# EAGLE design colourBit (EAGLE 9.5.2)
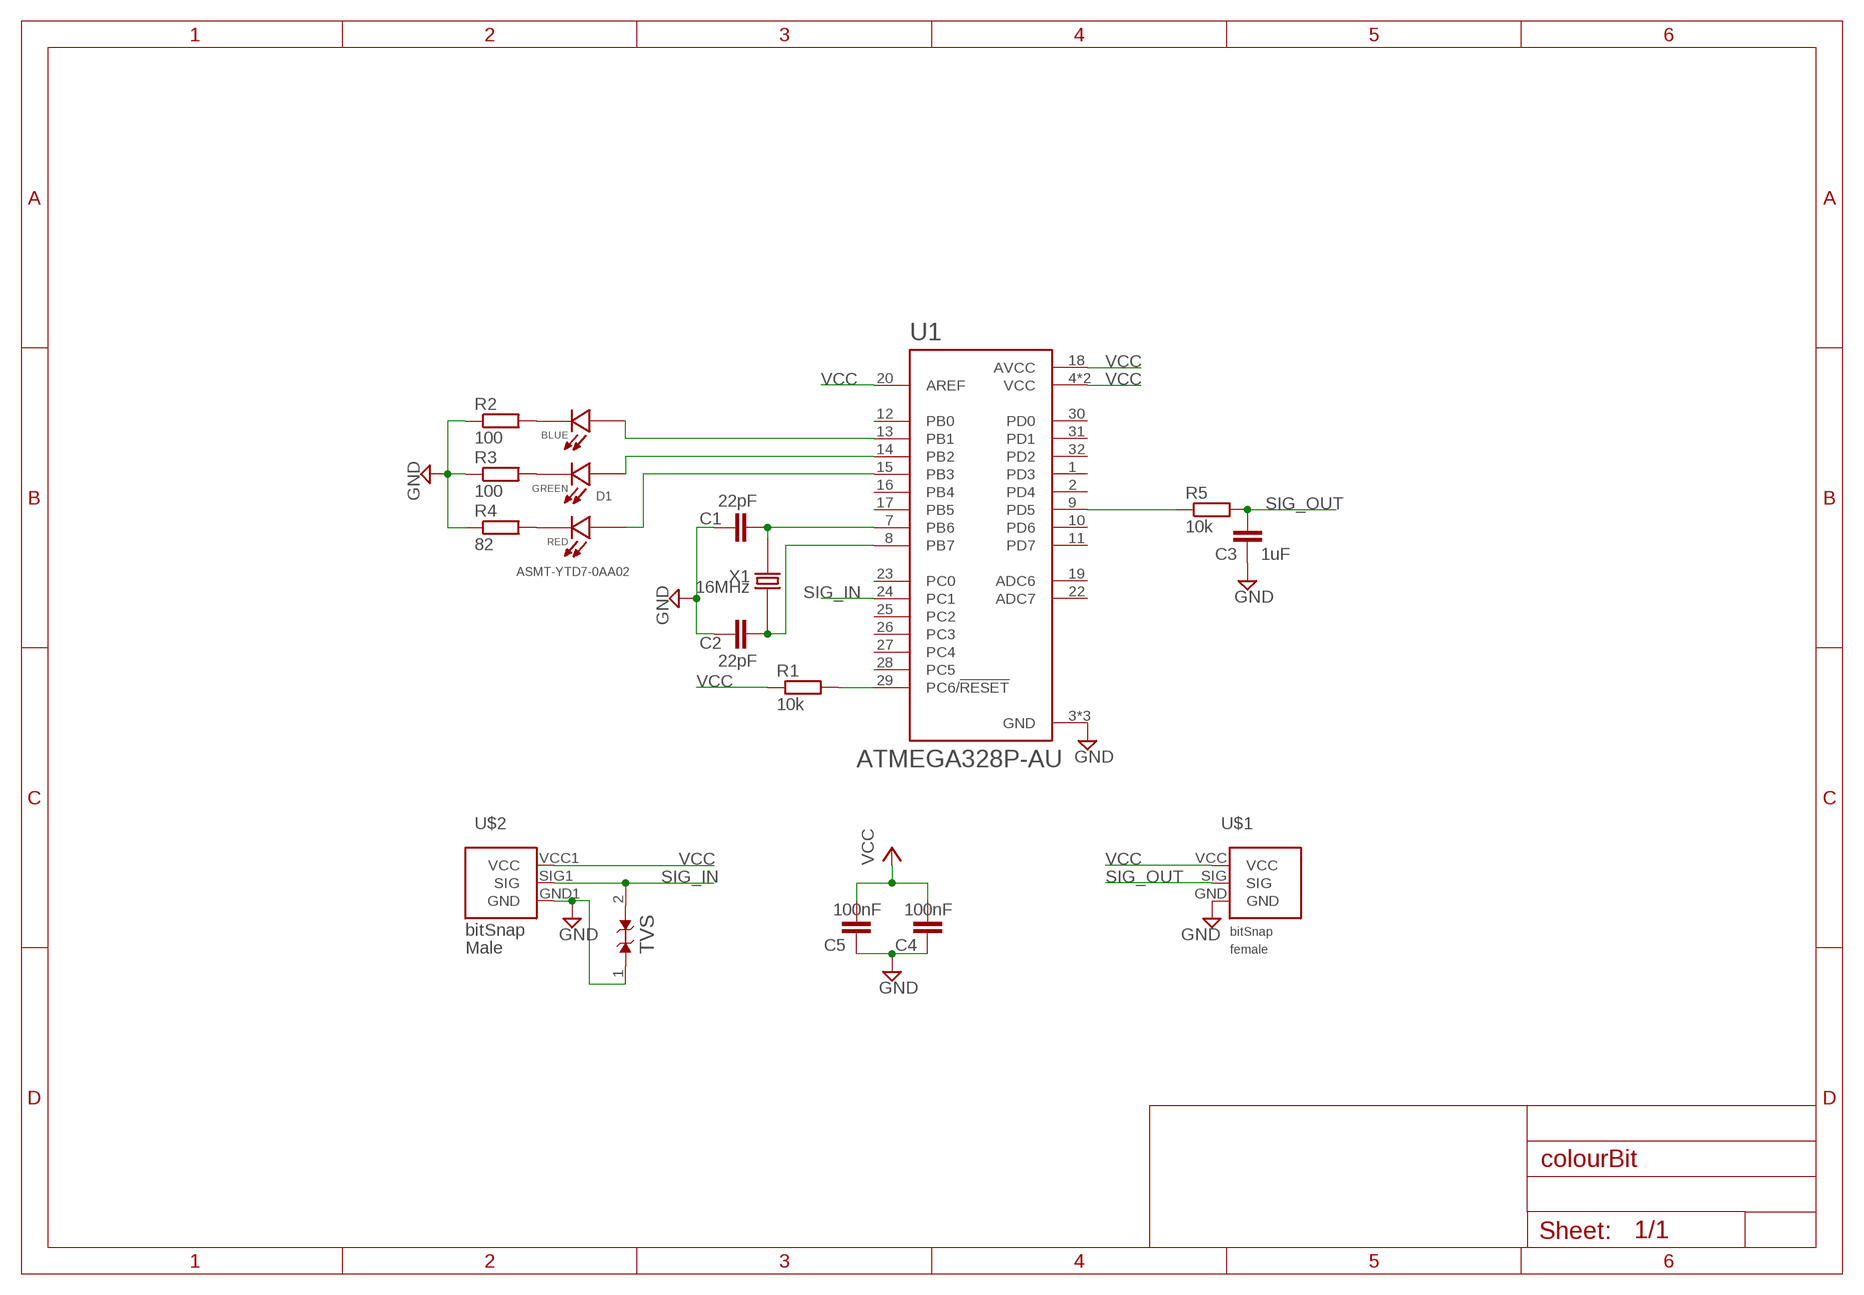
[diagram p0: schematic, sheet 1]

## Parts
C1  22pF  C-EUC0805  [C0805]
C2  22pF  C-EUC0805  [C0805]
C3  1uF  C-EUC0805  [C0805]
C4  100nF  C-EUC0805  [C0805]
C5  100nF  C-EUC0805  [C0805]
D1  ASMT-YTD7-0AA02  [LED_ASMT-YTD7-0AA02]
R1  10k  R-EU_R0805  [R0805]
R2  100  R-EU_R0805  [R0805]
R3  100  R-EU_R0805  [R0805]
R4  82  R-EU_R0805  [R0805]
R5  10k  R-EU_R0805  [R0805]
TVS  ESD9B5.0ST5G  [SODFL1006X40N]
U1  ATMEGA328P-AU  [QFP80P900X900X120-32N]
U$1  BITSNAP_V03_FEMALE  [BITSNAP_V03_FEMALE]
U$2  BITSNAP_V03_MALE  [BITSNAP_V03_MALE]
X1  16MHz  7A-24.000MAAJ-T  [XTAL500X320X120]

## Nets
GND: C1.1 C2.1 C3.1 C4.1 C5.1 R2.1 R3.1 R4.1 TVS.1(A) U1.3(GND) U1.5(GND) U1.21(GND) U$1.GND U$2.GND1(GND)
N$2: C1.2 U1.7(PB6) X1.2
N$4: C2.2 U1.8(PB7) X1.1
N$5: R1.2 U1.29(PC6/!RESET)
N$6: D1.1(B_C) R2.2
N$7: D1.2(G_C) R3.2
N$8: D1.3(R_C) R4.2
N$9: D1.6(B_A) U1.13(PB1)
N$10: D1.5(G_A) U1.14(PB2)
N$11: D1.4(R_A) U1.15(PB3)
N$13: R5.1 U1.9(PD5)
SIG_IN: TVS.2(A1) U1.24(PC1) U$2.SIG1(SIG)
SIG_OUT: C3.2 R5.2 U$1.SIG
VCC: C4.2 C5.2 R1.1 U1.4(VCC) U1.6(VCC) U1.18(AVCC) U1.20(AREF) U$1.VCC U$2.VCC1(VCC)
Unconnected: U1.1(PD3) U1.2(PD4) U1.10(PD6) U1.11(PD7) U1.12(PB0) U1.16(PB4) U1.17(PB5) U1.19(ADC6) U1.22(ADC7) U1.23(PC0) U1.25(PC2) U1.26(PC3) U1.27(PC4) U1.28(PC5) U1.30(PD0) U1.31(PD1) U1.32(PD2)

## Library data of the parts
C1-C5 = rcl:C-EU: CAPACITOR, European symbol; SPICEPREFIX: C
D1 = ASMT-YTD7-0AA02:ASMT-YTD7-0AA02: SMD LED RGB 1.8...3.6 V PLCC-6 | Broadcom ASMTYTD70AA02 @ LED, SMD (SMD LED RGB 1.8...3.6 V PLCC-6 LEDs – SMD).; AVAILABILITY: Unavailable; DESCRIPTION: Red, Green, Blue _RGB_ 623nm Red, 529nm Green, 469nm Blue LED Indication - Discrete 2.1V Red, 3.1V Green, 3.1V Blue 6-SMD, J-Lead; MF: Broadcom Limited; MP: ASMT-YTD7-0AA02; PACKAGE: PLCC-6 Broadcom; PRICE: None
R1-R5 = rcl:R-EU_: RESISTOR, European symbol; SPICEPREFIX: R
TVS = ESD9B5.0ST5G:ESD9B5.0ST5G: ESD9B Series 7.8 V 15 pF Surface Mount TVS Diode - SOD-923; AVAILABILITY: Unavailable; DESCRIPTION: Clamp Ipp Tvs Diode Surface Mount SOD-923; MF: ON Semiconductor; MP: ESD9B5.0ST5G; PACKAGE: SOD-923 ON Semiconductor; PRICE: None
U1 = ATMEGA328P-AU:ATMEGA328P-AU: ATmega Series 20 MHz 32 KB Flash 2 KB SRAM 8-Bit Microcontroller - TQFP-32; AVAILABILITY: Unavailable; DESCRIPTION: AVR AVR® ATmega Microcontroller IC 8-Bit 20MHz 32KB _16K x 16_ FLASH 32-TQFP _7x7_; MF: Microchip Technology; MP: ATMEGA328P-AU; PACKAGE: TQFP-32 Microchip Technology; PRICE: None
U$1 = bitSnap140813:BITSNAP_V03_FEMALE
U$2 = bitSnap140813:BITSNAP_V03_MALE
X1 = 7A-24.000MAAJ-T:7A-24.000MAAJ-T: Crystal 24MHz 30ppm (Tol) 30ppm (Stability) 18pF FUND 50Ohm 2-Pin SMD T/R; AVAILABILITY: Unavailable; DESCRIPTION: 24MHz ±30ppm Crystal 18pF 50 Ohms 2-SMD, No Lead; MF: TXC; MP: 7A-24.000MAAJ-T; PACKAGE: SMD-2 TXC; PRICE: None

## Board
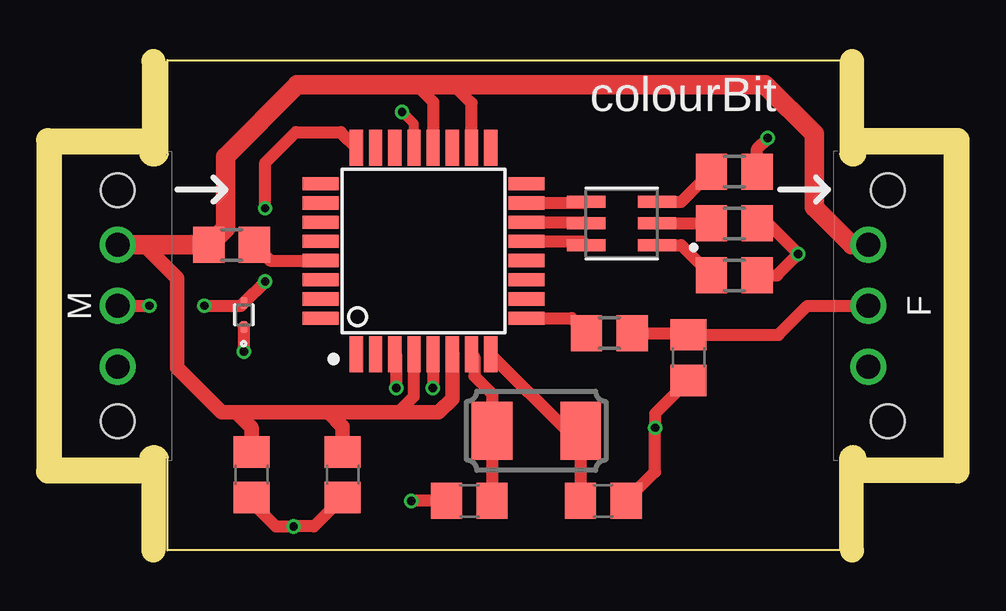
[diagram p1: board, top side]
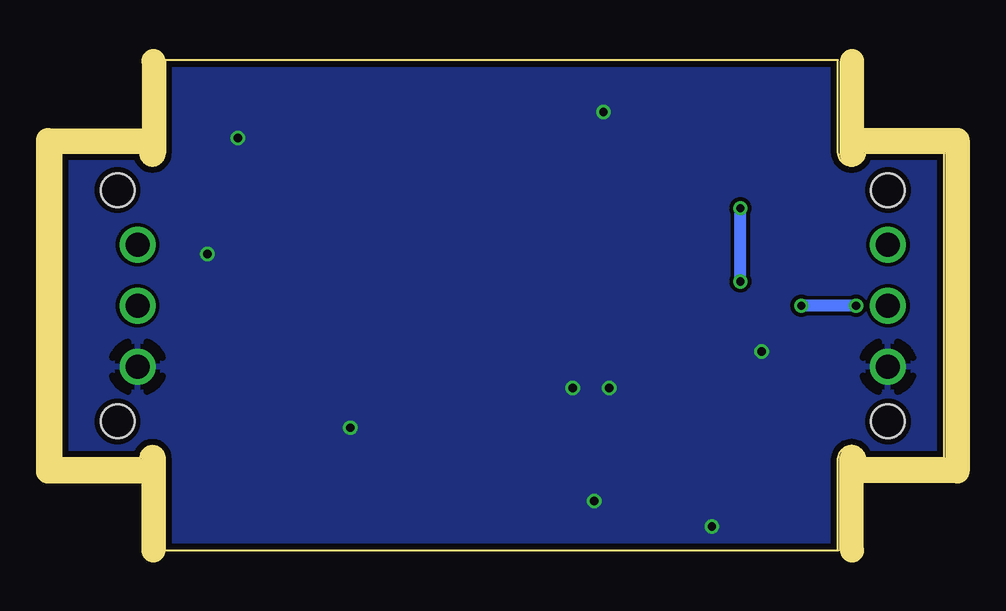
[diagram p2: board, bottom side, seen from below]

Size 36.92 x 20.44 mm. Coordinates in mm from the lower left corner, seen from the top.
Outline: 4.49,16.55 4.49,20.44 32.56,20.44 32.56,16.55 arc180 33.57,16.55 36.87,16.55 36.87,3.85 33.57,3.85 arc180 32.56,3.85 32.56,0.01 4.49,0.01 4.49,3.85 arc167 3.35,3.85 0.04,3.85 0.04,16.55 3.35,16.55 arc167 4.49,16.55
Copper layers (1*16): Top 0.018mm / dielectric 1.55mm / Bottom 0.018mm
Design rules "eC_2Layer_PClass6_BaseCopperO18_eCDefault": minimum track width 0.15mm, minimum drill 0.35mm, track to track 0.15mm, track to pad 0.15mm, pad to pad 0.15mm, via to via 0.15mm, smd to smd 0mil, copper to edge 0.25mm, drill to drill 0.35mm, minimum pad ring 0.175mm, minimum via ring 0.125mm, stop-mask expansion 0mil, vias tented up to drill 0.45mm, thermal gap 0.2mm

### Footprints (pad centres in the part's own frame; a part is rotated, then mirrored left to right if it is on the bottom)
C0805 = smd 1.3 x 1.5: 1 -0.95,0; 2 0.95,0
LED_ASMT-YTD7-0AA02 = smd 1.6 x 0.5: 1 -1.475,0.9; 2 -1.475,0; 3 -1.475,-0.9; 4 1.475,-0.9; 5 1.475,0; 6 1.475,0.9
R0805 = smd 1.3 x 1.5: 1 -0.95,0; 2 0.95,0
SODFL1006X40N = smd 0.5 x 0.3: 1 -0.5,0; 2 0.5,0
QFP80P900X900X120-32N = smd 1.5 x 0.55: 1 -4.3,2.8; 2 -4.3,2; 3 -4.3,1.2; 4 -4.3,0.4; 5 -4.3,-0.4; 6 -4.3,-1.2; 7 -4.3,-2; 8 -4.3,-2.8; 17 4.3,-2.8; 18 4.3,-2; 19 4.3,-1.2; 20 4.3,-0.4; 21 4.3,0.4; 22 4.3,1.2; 23 4.3,2; 24 4.3,2.8 | smd 0.55 x 1.5: 9 -2.8,-4.3; 10 -2,-4.3; 11 -1.2,-4.3; 12 -0.4,-4.3; 13 0.4,-4.3; 14 1.2,-4.3; 15 2,-4.3; 16 2.8,-4.3; 25 2.8,4.3; 26 2,4.3; 27 1.2,4.3; 28 0.4,4.3; 29 -0.4,4.3; 30 -1.2,4.3; 31 -2,4.3; 32 -2.8,4.3
BITSNAP_V03_FEMALE = drill 1: GND 4.065,3.44; SIG 6.605,3.44; VCC 9.145,3.44 | hole 1.4: 1.785,2.61; 11.425,2.61
BITSNAP_V03_MALE = drill 1: GND1 9.145,2.61; SIG1 6.605,2.61; VCC1 4.065,2.61 | hole 1.4: 1.785,2.61; 11.425,2.61
XTAL500X320X120 = smd 1.7 x 2.4: 1 -1.85,0; 2 1.85,0

### Placement (x,y rotation side)
C1  17.06,2.07 0 top
C2  22.65,2.07 180 top
C3  26.21,8.04 90 top
C4  7.99,3.16 90 top
C5  11.79,3.16 90 top
D1  23.41,13.63 180 top
R1  7.16,12.74 0 top
R2  28.11,11.47 180 top
R3  28.11,13.63 180 top
R4  28.11,15.79 180 top
R5  22.9,9.06 0 top
TVS  7.66,9.82 90 top
U1  15.16,12.49 90 top
U$1  37.13,3.6 90 top
U$2  -0.21,16.8 270 top
X1  19.86,4.99 180 top

### Tracks (layer width: path | path; a pad name or v marks a point on that pad's centre or on a via)
GND  (via drill 0.35)
  Top 0.406: U1.21 14.76,17.79 v14.26,18.28
  Top 0.508: R4.1 29.06,16.74 v29.51,17.19 | R3.1 29.51,13.63 v30.78,12.36 29.89,11.47 R2.1 | C1.1 v14.65,2.07 | C2.1 24.81,3.28 v24.81,5.12 24.81,5.7 C3.1 | U1.5 15.56,6.79 v15.54,6.77 | U1.3 14.01,8.13 v14.01,6.77 | TVS.1 v7.66,8.3 | C4.1 7.99,2.01 8.99,1.01 v9.74,1.01 10.59,1.01 C5.1
  pour Bottom: -0.34,20.87 37.38,20.87 37.38,-0.72 -0.21,-0.72 -0.21,6.39 -0.21,20.74 -0.34,20.74
N$2
  Top 0.508: U1.7 17.28,8.07 17.28,7.27 18.01,6.54 X1.2 C1.2
N$4
  Top 0.508: U1.8 21.15,4.99 X1.1 C2.2
N$5
  Top 0.508: R1.2 8.76,12.09 U1.29
N$6
  Top 0.508: D1.1 25.9,12.73 R2.2
N$7
  Top 0.508: D1.2 R3.2
N$8
  Top 0.508: D1.3 25.9,14.53 R4.2
N$9
  Top 0.508: U1.13 21.78,12.89 D1.6
N$10
  Top 0.508: U1.14 21.88,13.69 D1.5
N$11
  Top 0.508: U1.15 21.89,14.49 D1.4
N$13
  Top 0.508: U1.9 21.32,9.69 R5.1
SIG_IN  (via drill 0.35)
  Top 0.508: U$2.SIG1 v3.73,10.2 | v6.01,10.2 7.54,10.2 TVS.2 8.55,11.21 v8.55,11.22 | v8.55,14.27 8.55,16.17 9.82,17.44 11.7,17.44 U1.24
  Bottom 0.508: v3.73,10.2 v6.01,10.2 | v8.55,11.22 v8.55,14.27
SIG_OUT
  Top 0.508: R5.2 26.14,9.06 C3.2 29.95,8.99 31.16,10.2 U$1.SIG
VCC
  Top 0.508: 14.09,5.76 14.76,6.43 U1.4 | 14.84,19.41 15.56,18.69 U1.20 | U1.18 17.16,18.64 16.39,19.41
  Top 0.61: 3.49,12.74 4.89,11.34 4.89,7.61 6.74,5.76 7.34,5.76 | 7.34,5.76 11.19,5.76 | 11.19,5.76 14.09,5.76 15.79,5.76 16.36,6.33 U1.6 | 7.34,5.76 7.99,5.11 C4.2 | C5.2 11.79,5.16 11.19,5.76
  Top 0.813: U$1.VCC 33.01,12.74 31.44,14.31 31.44,17.36 29.39,19.41 16.39,19.41 14.84,19.41 9.89,19.41 6.9,16.42 6.9,13.44 R1.1 3.49,12.74 U$2.VCC1

### Text on the board
tPlace: colourBit